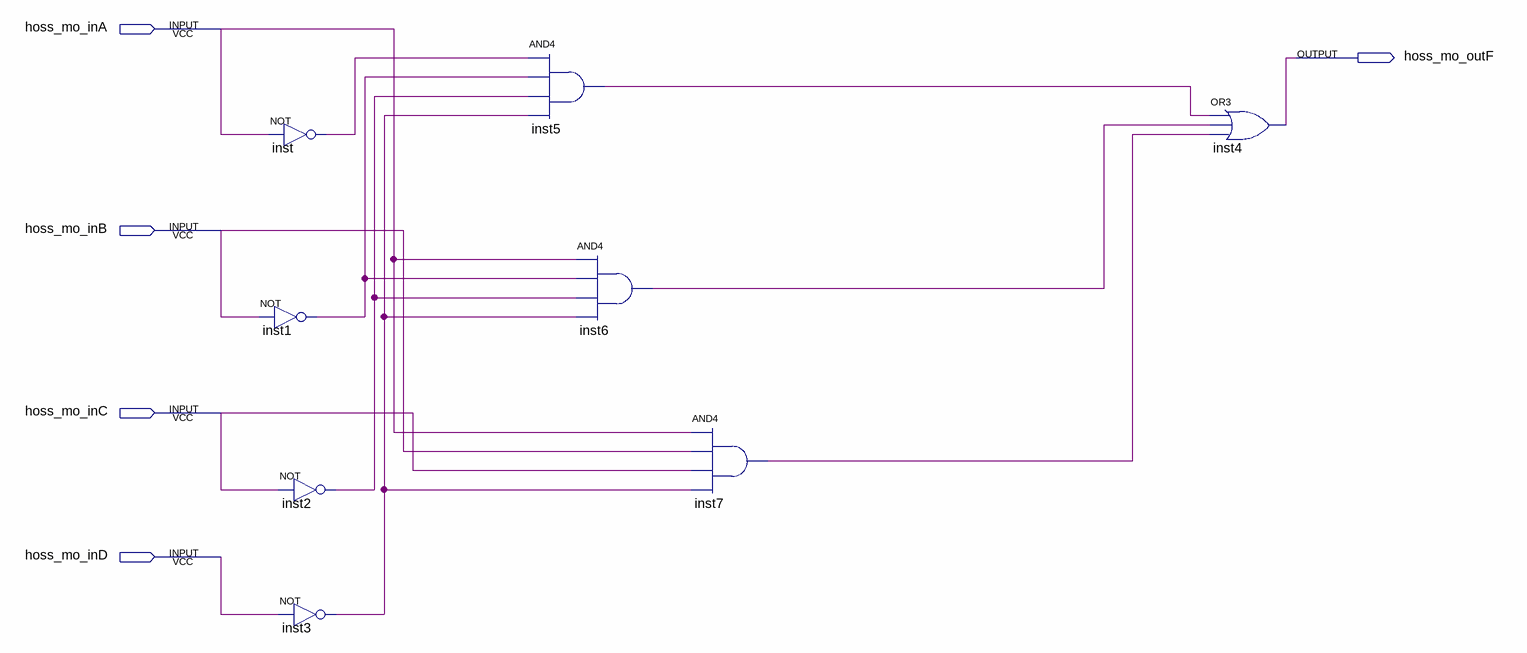
[diagram p0: schematic sheet]
// Quartus schematic segmentG.bdf as structural Verilog: 8 symbols, 5 pins
module segmentG (
  input  hoss_mo_inA,
  input  hoss_mo_inB,
  input  hoss_mo_inC,
  input  hoss_mo_inD,
  output hoss_mo_outF
);

  wire inst1_out, inst2_out, inst3_out, inst5_out, inst6_out, inst7_out, inst_out;

  not inst (inst_out, hoss_mo_inA);
  not inst1 (inst1_out, hoss_mo_inB);
  not inst2 (inst2_out, hoss_mo_inC);
  not inst3 (inst3_out, hoss_mo_inD);
  and inst5 (inst5_out, inst_out, inst1_out, inst2_out, inst3_out);
  and inst6 (inst6_out, hoss_mo_inA, inst1_out, inst2_out, inst3_out);
  and inst7 (inst7_out, hoss_mo_inA, hoss_mo_inB, hoss_mo_inC, inst3_out);
  or inst4 (hoss_mo_outF, inst5_out, inst6_out, inst7_out);
endmodule
